# Altium project Optoisolator-Board.PrjPcb
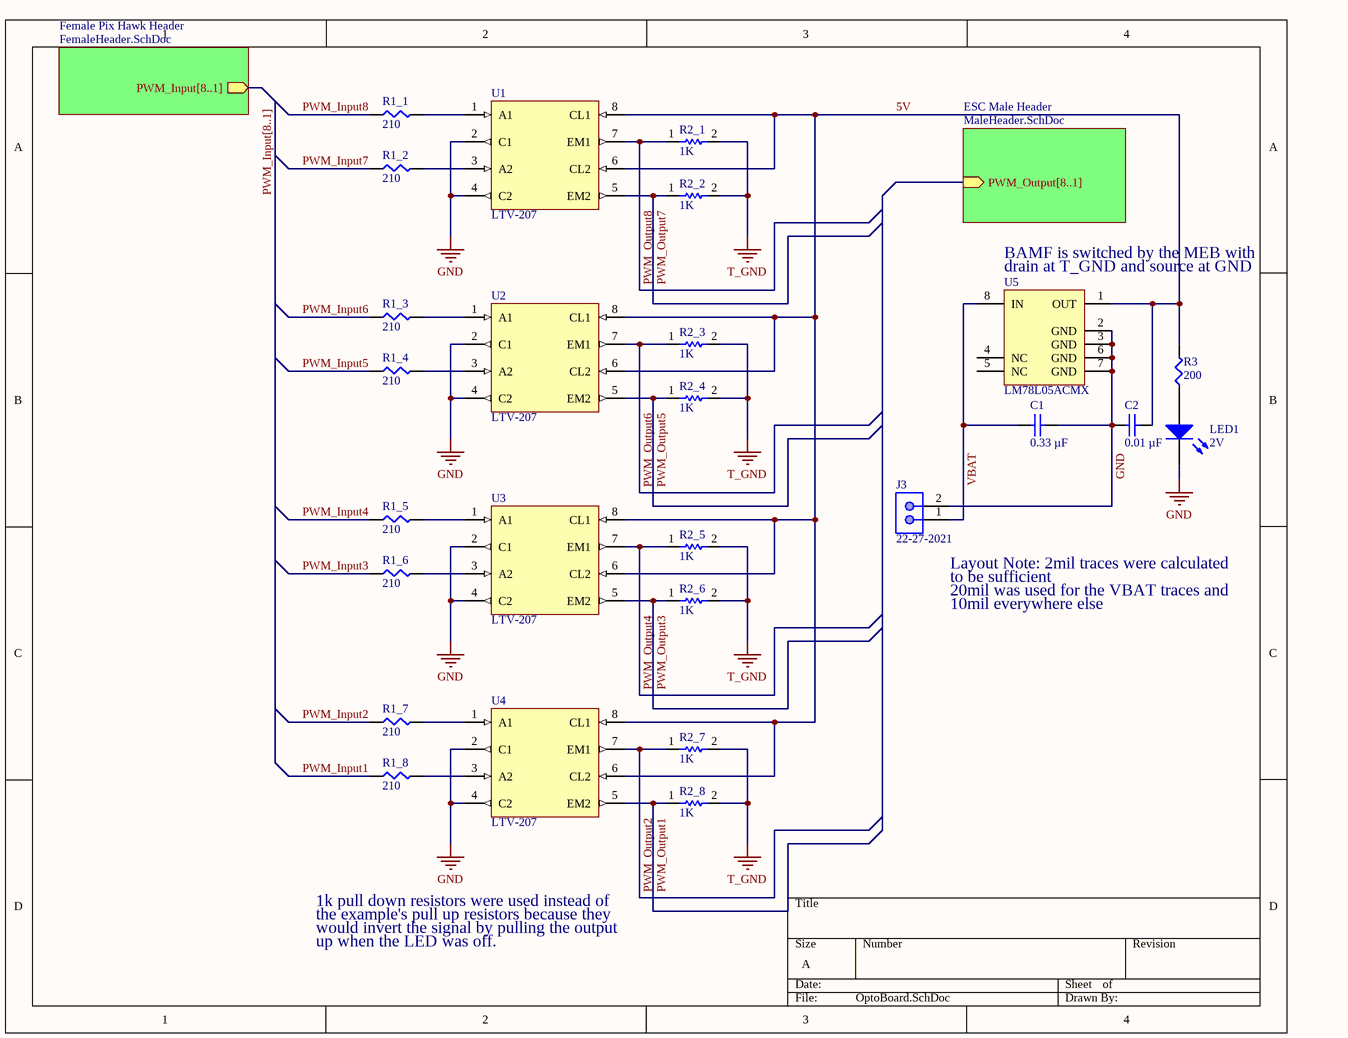
[diagram p0: OptoBoard.SchDoc]
3 sheets, 28 parts. Net scope: hierarchical (ports join the sheet entries above them; power ports are global).
Board file: OptoPCB.PcbDoc
Sheets:
  OptoBoard.SchDoc
    Female Pix Hawk Header = FemaleHeader.SchDoc
    ESC Male Header = MaleHeader.SchDoc

## Sheet OptoBoard.SchDoc
size A

### Parts
C1  0.33 µF  [CAPC2013X95X45ML10T25]
C2  0.01 µF  [CAPC2013X70X45LL15T25]
J3  22-27-2021  [MOLX-22-27-2021_V]
LED1  2V  [1206  CYLINDRICAL- Reverse Use]
R1_1  210  [SMD-0805-RES]
R1_2  210  [SMD-0805-RES]
R1_3  210  [SMD-0805-RES]
R1_4  210  [SMD-0805-RES]
R1_5  210  [SMD-0805-RES]
R1_6  210  [SMD-0805-RES]
R1_7  210  [SMD-0805-RES]
R1_8  210  [SMD-0805-RES]
R2_1  1K  [RESC2013X60X35ML10T20]
R2_2  1K  [RESC2013X60X35ML10T20]
R2_3  1K  [RESC2013X60X35ML10T20]
R2_4  1K  [RESC2013X60X35ML10T20]
R2_5  1K  [RESC2013X60X35ML10T20]
R2_6  1K  [RESC2013X60X35ML10T20]
R2_7  1K  [RESC2013X60X35ML10T20]
R2_8  1K  [RESC2013X60X35ML10T20]
R3  200  [SMD-0805-RES]
U1  LTV-207  [ZMDI-SOP-8_N]
U2  LTV-207  [ZMDI-SOP-8_N]
U3  LTV-207  [ZMDI-SOP-8_N]
U4  LTV-207  [ZMDI-SOP-8_N]
U5  LM78L05ACMX  [D0008A_N]

### Sub-sheets
ESC Male Header = MaleHeader.SchDoc: PWM_Output[8..1] (in)
Female Pix Hawk Header = FemaleHeader.SchDoc: PWM_Input[8..1] (out)

### Nets
GND: C1.2 C2.1 J3.2 LED1.1(K) U1.2(C1) U1.4(C2) U2.2(C1) U2.4(C2) U3.2(C1) U3.4(C2) U4.2(C1) U4.4(C2) U5.2(GND) U5.3(GND) U5.6(GND) U5.7(GND)
T_GND: R2_1.2 R2_2.2 R2_3.2 R2_4.2 R2_5.2 R2_6.2 R2_7.2 R2_8.2
5V: C2.2 R3.2 U1.6(CL2) U1.8(CL1) U2.6(CL2) U2.8(CL1) U3.6(CL2) U3.8(CL1) U4.6(CL2) U4.8(CL1) U5.1(OUT)
PWM_Input1: R1_8.1
PWM_Input2: R1_7.1
PWM_Input3: R1_6.1
PWM_Input4: R1_5.1
PWM_Input5: R1_4.1
PWM_Input6: R1_3.1
PWM_Input7: R1_2.1
PWM_Input8: R1_1.1
PWM_Output1: R2_8.1 U4.5(EM2)
PWM_Output2: R2_7.1 U4.7(EM1)
PWM_Output3: R2_6.1 U3.5(EM2)
PWM_Output4: R2_5.1 U3.7(EM1)
PWM_Output5: R2_4.1 U2.5(EM2)
PWM_Output6: R2_3.1 U2.7(EM1)
PWM_Output7: R2_2.1 U1.5(EM2)
PWM_Output8: R2_1.1 U1.7(EM1)
VBAT: C1.1 J3.1 U5.8(IN)
NetLED1_2: LED1.2(A) R3.1
NetR1_1_2: R1_1.2 U1.1(A1)
NetR1_2_2: R1_2.2 U1.3(A2)
NetR1_3_2: R1_3.2 U2.1(A1)
NetR1_4_2: R1_4.2 U2.3(A2)
NetR1_5_2: R1_5.2 U3.1(A1)
NetR1_6_2: R1_6.2 U3.3(A2)
NetR1_7_2: R1_7.2 U4.1(A1)
NetR1_8_2: R1_8.2 U4.3(A2)

Not connected (* = marked no-connect by the designer): U5 4(NC) 5(NC)

### Buses and harness runs
bus PWM_Input[8..1] = sheet Female Pix Hawk Header/PWM_Input[8..1]

### Notes on the sheet
- (near U5) BAMF is switched by the MEB with
- (near U5) drain at T_GND and source at GND
- (near J3) Layout Note: 2mil traces were calculated
- to be sufficient
- 20mil was used for the VBAT traces and
- 10mil everywhere else
- 1k pull down resistors were used instead of
- the example's pull up resistors because they
- would invert the signal by pulling the output
- up when the LED was off.

### Library data of the parts
C1 = CMP-1036-04606-2: ±10% 50V Ceramic Capacitor X7R 0805 (2012 Metric); Manufacturer: Murata; Part Number: GRM219R71H334KA88D; Manufacturer Part Number: GRM219R71H334KA88D; Value: 0.33 µF
C2 = CMP-2007-00806-1: ±10% 100V Ceramic Capacitor X7R 0805 (2012 Metric); Manufacturer: Murata; Part Number: GCM216R72A103KA37D; Manufacturer Part Number: GCM216R72A103KA37D; Value: 0.01 µF
J3 = CMP-2000-05537-1: Male Header, Pitch 2.54 mm, 1 x 2 Position, Height 11.7 mm, Tail Length 3.56 mm, 0 to 75 degC, RoHS, Bulk; Manufacturer: Molex; PartNumber: 0022272021; Manufacturer Part Number: AE-6410-2A; Current rating: 4A; Package Version: Rev. BC, 02/2012; Voltage rating: 250V; No. of Positions: 2; Pitch: 2.54mm; No. of Rows: 1; Orientation: Vertical; Operating temperature: 0°Cto+75°C; Manufacturer URL: http://www.molex.com/; Mounting Technology: ThroughHole; Housing material: Nylon(UL94V-0); Package Description: 2-Leads Header, Body 5.08 x 5.8 mm, Pitch 2.54 mm; Voltage - Max: 250V; Datasheet URL: http://www.molex.com/pdm_docs/sd/022272021_sd.pdf; Package Reference: 22-27-2021; Contact material: Tinplatedbrass; Current - Max: 4A; Datasheet Version: Rev. F, 06/2009
LED1 = CMP-1428-00003-2: SMD mono-color reverse mount waterclear Chip LED, WL-SMRW, Red, 156120RS75300; Manufacturer: Wuerth Elektronik; Lens Type: Cylindrical; Color: Red; PackageReference: 1206  CYLINDRICAL- Reverse Use; ComponentLink2Description: Datasheet; PartNumber: 156120RS75300; ComponentLink1Description: Manufacturer URL; ComponentLink2URL: http://katalog.we-online.com/led/datasheet/156120RS75300.pdf; ComponentLink1URL: http://www.we-online.com; Manufacturer Part Number: 156120RS75300; Value: 2V
R1_1-R1_8 = ERJ-6ENF2100V: RES SMD 210 OHM 1% 1/8W 0805; Manufacturer: Panasonic Electronic Components; Factory Stock: 0; Unit Price (USD): 0.00729; @ qty: 1500; Minimum Quantity: 1; Power (Watts): 0.125W, 1/8W; Temperature Coefficient: ±100ppm/°C; Part Number: ERJ-6ENF2100V; Datasheets: http://industrial.panasonic.com/www-cgi/jvcr13pz.cgi?E+PZ+3+AOA0002+ERJ6ENF2100V+7+WW; Image: //media.digikey.com/Renders/Panasonic%20Renders/ERJ-0805%20Pkg.jpg; Digi-Key Part Number: P210CCT-ND; Quantity Available: 47737; Packaging: Cut Tape (CT); Series: ERJ; Part Status: Active; Value: 210; Tolerance: ±1%; Composition: Thick Film; Features: Automotive AEC-Q200; Operating Temperature: -55°C ~ 155°C; Package / Case: 0805 (2012 Metric); Supplier Device Package: 0805; Size / Dimension: 0.079" L x 0.049" W (2.00mm x 1.25mm); Height - Seated (Max): 0.028" (0.70mm); Number of Terminations: 2; Failure Rate: -; Manufacturer Part Number: ERJ-6ENF2100V
R2_1-R2_8 = CMP-2100-03671-1: Chip Resistor, 1 KOhm, +/- 1%, 125 mW, -55 to 155 degC, 0805 (2012 Metric), RoHS, Tape and Reel; Manufacturer: Yageo; Manufacturer Part Number: RC0805FR-071KL; Temperature Coefficient: 100ppm/degreesC; Voltage Rating (DC): 150V; Max Power Dissipation: 125mW; Resistance: 1KOhm; Value: 1 kohm; Number of Pins: 2; Number of Terminations: 2; Datasheet URL: http://www.yageo.com/NewPortal/yageodocoutput?fileName=/pdf/R-Chip/PYu-RC_Group_51_RoHS_L_5.pdf; Length: 0.079inch; Package Description: 2-Pin Surface Mounted Device, Body 2 x 1.25 mm; Depth: 1.25mm; Height: 0.024inch; Military Standard: Not; Case/Package: 0805; Package Reference: 0805; RoHSCompliant: true; Lead Free: LeadFree; Packaging: TapeandReel; Package Quantity: 1; Datasheet Version: Rev. 5, 10/2016; Tolerance: 1%; Min Operating Temperature: -55degC; Voltage Rating: 150V; Composition: ThickFilm; Case Code (Imperial): 0805; Power Rating: 125mW; Width: 0.049inch; Case Code (Metric): 2012; Manufacturer URL: http://www.yageo.com/; Max Operating Temperature: 155degC; REACH SVHC: Unknown; Termination: SMD/SMT
R3 = ERJ-6ENF2000V: RES SMD 200 OHM 1% 1/8W 0805; Manufacturer: Panasonic Electronic Components; Factory Stock: 0; Unit Price (USD): 0.00729; @ qty: 1500; Minimum Quantity: 1; Power (Watts): 0.125W, 1/8W; Temperature Coefficient: ±100ppm/°C; Part Number: ERJ-6ENF2000V; Datasheets: http://industrial.panasonic.com/www-cgi/jvcr13pz.cgi?E+PZ+3+AOA0002+ERJ6ENF2000V+7+WW; Image: //media.digikey.com/Renders/Panasonic%20Renders/ERJ-0805%20Pkg.jpg; Digi-Key Part Number: P200CCT-ND; Quantity Available: 150759; Packaging: Cut Tape (CT); Series: ERJ; Part Status: Active; Value: 200; Tolerance: ±1%; Composition: Thick Film; Features: Automotive AEC-Q200; Operating Temperature: -55°C ~ 155°C; Package / Case: 0805 (2012 Metric); Supplier Device Package: 0805; Size / Dimension: 0.079" L x 0.049" W (2.00mm x 1.25mm); Height - Seated (Max): 0.028" (0.70mm); Number of Terminations: 2; Failure Rate: -; Manufacturer Part Number: ERJ-6ENF2000V
U1-U4 = CMP-0848-00007-1: Transistor Output Optocouplers SO8 100-200% 3.75KV 2CH Optocoupler; Manufacturer: Lite-On Inc.; ComponentLink1Description: Manufacturer URL; ComponentLink3Description: Package Specification; ComponentLink1URL: http://www.zmdi.com/; ComponentLink2Description: Datasheet; ComponentLink3URL: http://www.zmdi.com/sites/default/files/ZLED7001_Data_Sheet_Rev_1.1.pdf; ComponentLink2URL: http://www.zmdi.com/sites/default/files/ZLED7010_DataSheet_Rev_1.1.pdf; Manufacturer Part Number: LTV-207
U5 = CMP-0062-01154-4: 3-Terminal Positive Regulator, 5 Vout, 8-pin Narrow SOIC, 2500 Reel; Manufacturer: Texas Instruments; High-Reliability: Y; PackageTopMarking: NSZXTT*LM78L*05ACM; PowerWise: N; CompType: LDO IC; ComponentLink1Description: Datasheet URL; PackageReference: D0008A; PackageDescription: SOIC Narrow, 4.9 x 3.9 x 1.45mm, 8 Lead, 1.27mm Pitch; Code_JEDEC: MS-012-AA; Code_IPC: SOIC127P600-8; RoHS: N; PartNumber: LM78L05ACMX; ComponentLink1URL: http://www.ti.com/general/docs/lit/getliterature.tsp?genericPartNumber=LM78L05&fileType=pdf; PinCount: 8

## Sheet FemaleHeader.SchDoc
size A
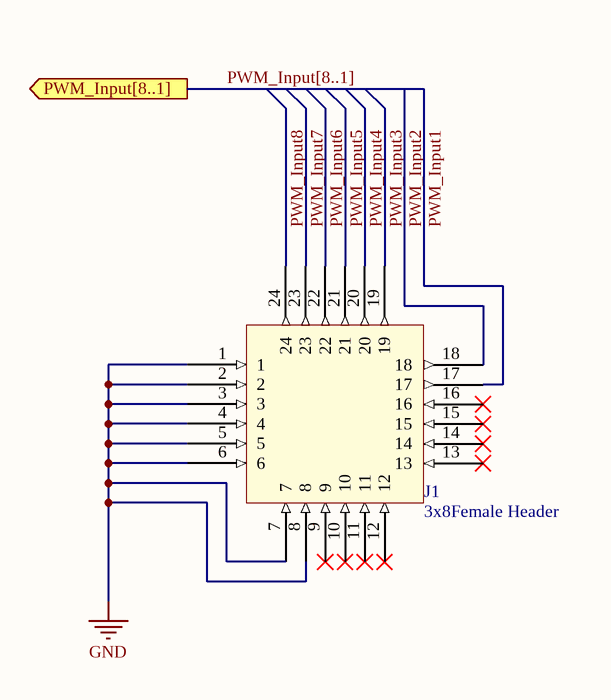
[diagram p1: FemaleHeader.SchDoc]

### Parts
J1  3x8Female Header  [3x8 Female Header]

### Ports
PWM_Input[8..1] (out)

### Nets
GND: J1.1 J1.2 J1.3 J1.4 J1.5 J1.6 J1.7 J1.8
PWM_Input1: J1.17
PWM_Input2: J1.18
PWM_Input3: J1.19
PWM_Input4: J1.20
PWM_Input5: J1.21
PWM_Input6: J1.22
PWM_Input7: J1.23
PWM_Input8: J1.24

Not connected (* = marked no-connect by the designer): J1 9* 10* 11* 12* 13* 14* 15* 16*

### Buses and harness runs
bus PWM_Input[8..1] = port PWM_Input[8..1]

### Library data of the parts
J1 = 3x8 Female Header: Manufacturer: URC; Manufacturer Part Number: Custom

## Sheet MaleHeader.SchDoc
size A
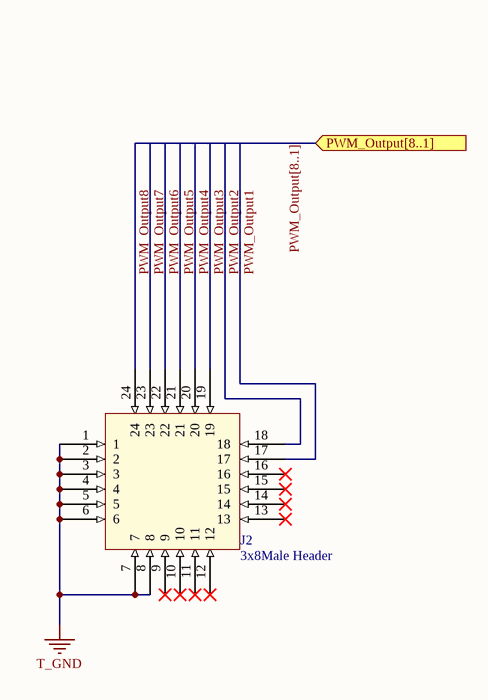
[diagram p2: MaleHeader.SchDoc]

### Parts
J2  3x8Male Header  [3x8 Male Header]

### Ports
PWM_Output[8..1] (in)

### Nets
T_GND: J2.1 J2.2 J2.3 J2.4 J2.5 J2.6 J2.7 J2.8
PWM_Output1: J2.17
PWM_Output2: J2.18
PWM_Output3: J2.19
PWM_Output4: J2.20
PWM_Output5: J2.21
PWM_Output6: J2.22
PWM_Output7: J2.23
PWM_Output8: J2.24

Not connected (* = marked no-connect by the designer): J2 9* 10* 11* 12* 13* 14* 15* 16*

### Buses and harness runs
bus PWM_Output[8..1] = port PWM_Output[8..1]

### Library data of the parts
J2 = 3x8Male Header: 3x8 male header

## Nets that join several sheets
GND: OptoBoard (16 pins), FemaleHeader (8 pins)
T_GND: OptoBoard (8 pins), MaleHeader (8 pins)
PWM_Input1: OptoBoard (R1_8.1), FemaleHeader (J1.17)
PWM_Input2: OptoBoard (R1_7.1), FemaleHeader (J1.18)
PWM_Input3: OptoBoard (R1_6.1), FemaleHeader (J1.19)
PWM_Input4: OptoBoard (R1_5.1), FemaleHeader (J1.20)
PWM_Input5: OptoBoard (R1_4.1), FemaleHeader (J1.21)
PWM_Input6: OptoBoard (R1_3.1), FemaleHeader (J1.22)
PWM_Input7: OptoBoard (R1_2.1), FemaleHeader (J1.23)
PWM_Input8: OptoBoard (R1_1.1), FemaleHeader (J1.24)